# EAGLE design CR2032 Power Module (EAGLE 6.1)
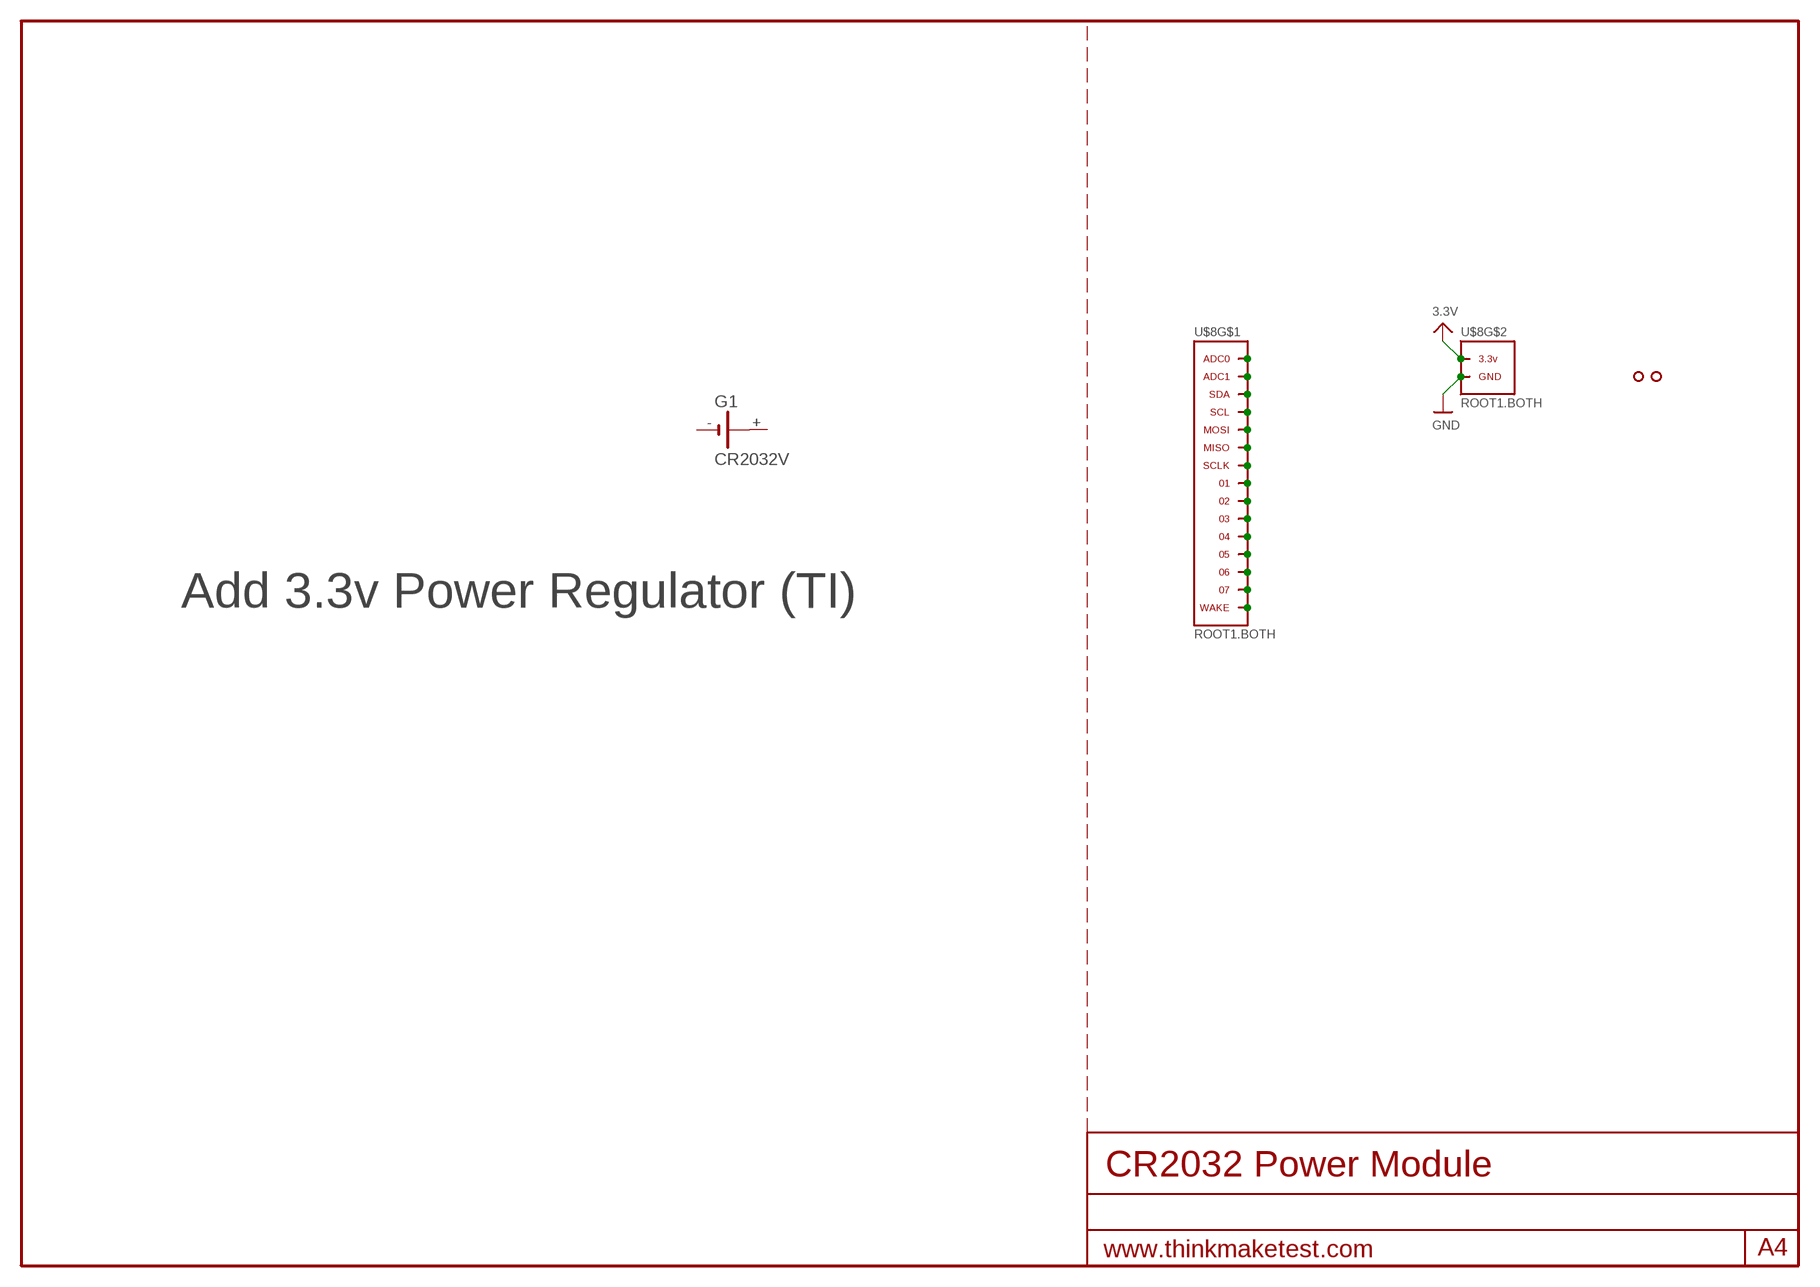
[diagram p0: schematic, sheet 1]

## Parts
G1  CR2032V  [CR2032V]
U$3  HOLE.2MM  [2MM]
U$4  HOLE.2MM  [2MM]
U$8  ROOT1.BOTH  [ROOT1.BOTH]

## Nets
3.3V: U$8.3.3V@1(3.3V) U$8.3.3V@2(3.3V) U$8.3.3V@3(3.3V) U$8.3.3V@4(3.3V) U$8.3.3V@5(3.3V) U$8.3.3V@6(3.3V) U$8.3.3V@7(3.3V) U$8.3.3V@8(3.3V) U$8.3.3V@9(3.3V) U$8.3.3V@10(3.3V) U$8.3.3V@VIA(3.3V)
GND: U$8.GND@1(GND) U$8.GND@2(GND) U$8.GND@3(GND) U$8.GND@4(GND) U$8.GND@5(GND) U$8.GND@6(GND) U$8.GND@7(GND) U$8.GND@8(GND) U$8.GND@9(GND) U$8.GND@10(GND) U$8.GND@11(GND) U$8.GND@12(GND) U$8.GND@13(GND) U$8.GND@14(GND) U$8.GND@15(GND) U$8.GND@16(GND) U$8.GND@17(GND) U$8.GND@18(GND) U$8.GND@19(GND) U$8.GND@20(GND) U$8.GND@VIA(GND)
N$1: U$8.ADC0 U$8.ADC0@1(ADC0) U$8.ADC0@VIA(ADC0)
N$2: U$8.ADC1 U$8.ADC1@1(ADC1) U$8.ADC1@VIA(ADC1)
N$3: U$8.SDA U$8.SDA@1(SDA) U$8.SDA@VIA(SDA)
N$4: U$8.SCL U$8.SCL@1(SCL) U$8.SCL@VIA(SCL)
N$5: U$8.MOSI U$8.MOSI@1(MOSI) U$8.MOSI@VIA(MOSI)
N$6: U$8.MISO U$8.MISO@1(MISO) U$8.MISO@VIA(MISO)
N$7: U$8.SCLK U$8.SCLK@1(SCLK) U$8.SCLK@VIA(SCLK)
N$8: U$8.01 U$8.01@1 U$8.01@VIA
N$9: U$8.02 U$8.02@1 U$8.02@VIA
N$10: U$8.03 U$8.03@1 U$8.03@VIA
N$11: U$8.04 U$8.04@1 U$8.04@VIA
N$12: U$8.05 U$8.05@1 U$8.05@VIA
N$13: U$8.06 U$8.06@1 U$8.06@VIA
N$14: U$8.07 U$8.07@1 U$8.07@VIA
N$15: U$8.WAKE U$8.WAKE@1(WAKE) U$8.WAKE@VIA(WAKE)
Unconnected: G1.+ G1.+@1(+) G1.-

## Notes on the sheet
- Add 3.3v Power Regulator (TI)

## Library data of the parts
G1 = battery:CR2032V: LI BATTERY Varta
U$3 U$4 = .screw_holes:HOLE
U$8 = thinkmaketest:ROOT1

## Board
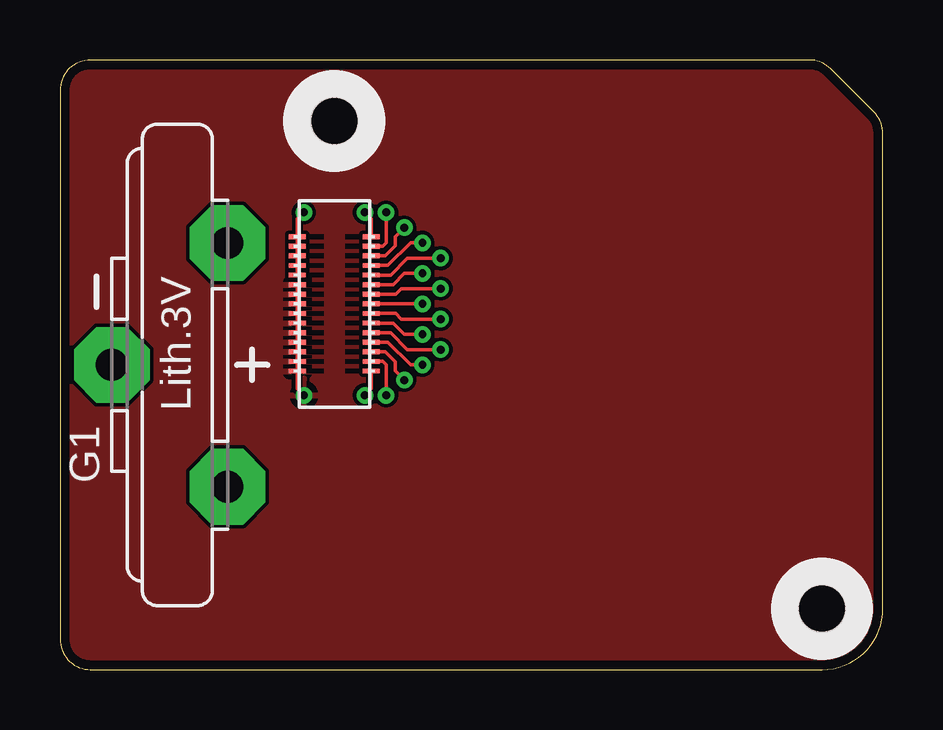
[diagram p1: board, top side]
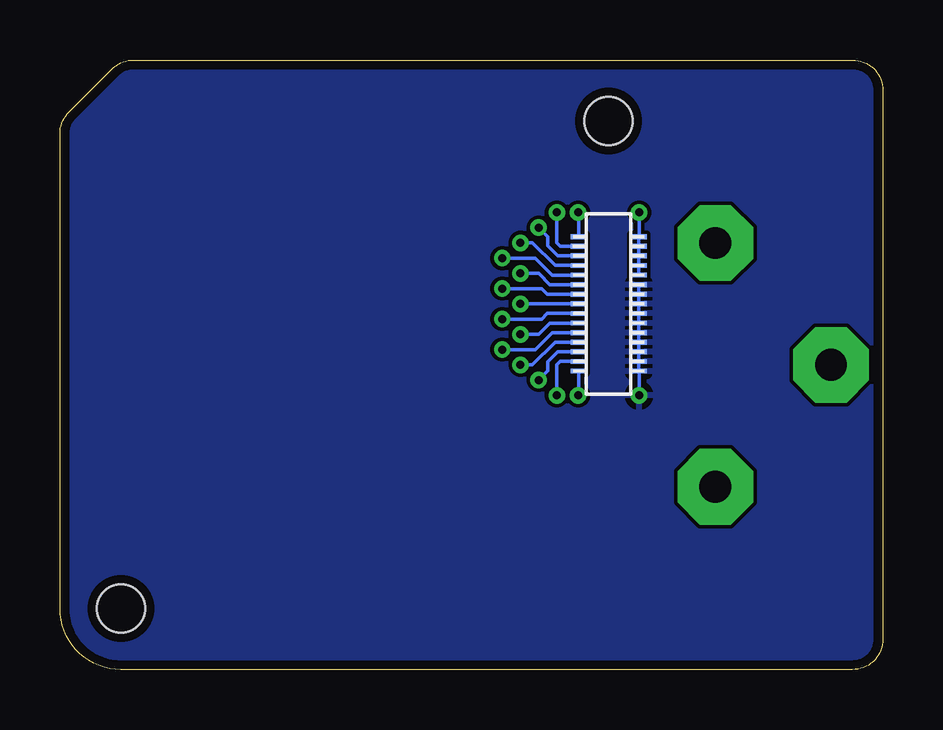
[diagram p2: board, bottom side, seen from below]

Size 34.29 x 25.4 mm. Coordinates in mm from the lower left corner, seen from the top.
Outline: 31.22,25.4 1.27,25.4 arc90 0,24.13 0,1.27 arc90 1.27,0 31.75,0 arc90 34.29,2.54 34.29,22.33 arc45 33.92,23.23 32.12,25.03 arc45 31.22,25.4
Copper layers (1*16): Top 0.0356mm / dielectric 1.5011mm / Bottom 0.0356mm
Design rules: minimum track width 6mil, minimum drill 13mil, track to track 6mil, track to pad 6mil, pad to pad 6mil, via to via 6mil, smd to smd 6mil, copper to edge 15mil, drill to drill 6mil, minimum pad ring 7mil, minimum via ring 7mil, stop-mask expansion 4mil, vias tented up to drill 16mil, thermal gap 10mil

### Footprints (pad centres in the part's own frame; a part is rotated, then mirrored left to right if it is on the bottom)
CR2032V = drill 1.321 pad 3.15 octagon: + -2.54,-5.08; +@1 -2.54,5.08; - 2.286,0
2MM = hole 2: 0,0
ROOT1.BOTH = smd 0.7 x 0.2: 01 4.08,15.24; 02 4.08,14.84; 03 4.08,14.44; 3.3V@1 1,18.04; 3.3V@2 1,17.64; 3.3V@3 1,17.24; 3.3V@4 1,16.84; 3.3V@5 1,16.44; 04 4.08,14.04; 05 4.08,13.64; 06 4.08,13.24; 07 4.08,12.84; ADC0 4.08,18.04; ADC1 4.08,17.64; GND@1 1,16.04; GND@2 1,15.64; GND@3 1,15.24; GND@4 1,14.84; GND@5 1,14.44; GND@6 1,14.04; GND@7 1,13.64; GND@8 1,13.24; GND@9 1,12.84; GND@10 1,12.44; MISO 4.08,16.04; MOSI 4.08,16.44; SCL 4.08,16.84; SCLK 4.08,15.64; SDA 4.08,17.24; WAKE 4.08,12.44 | smd 0.66 x 0.2 bottom: 01@1 3.795,15.24; 02@1 3.795,14.84; 3.3V@6 1.285,16.44; 3.3V@7 1.285,16.84; 3.3V@8 1.285,17.24; 3.3V@9 1.285,17.64; 3.3V@10 1.285,18.04; 03@1 3.795,14.44; 04@1 3.795,14.04; 05@1 3.795,13.64; 06@1 3.795,13.24; 07@1 3.795,12.84; ADC0@1 3.795,18.04; ADC1@1 3.795,17.64; GND@11 1.285,12.44; GND@12 1.285,12.84; GND@13 1.285,13.24; GND@14 1.285,13.64; GND@15 1.285,14.04; GND@16 1.285,14.44; GND@17 1.285,14.84; GND@18 1.285,15.24; GND@19 1.285,15.64; GND@20 1.285,16.04; MISO@1 3.795,16.04; MOSI@1 3.795,16.44; SCL@1 3.795,16.84; SCLK@1 3.795,15.64; SDA@1 3.795,17.24; WAKE@1 3.795,12.44 | drill 0.33 pad 0.686: 01@VIA 6.215,15.24; 02@VIA 6.973,14.605; 3.3V@VIA 1.27,19.05; 03@VIA 6.215,13.97; 04@VIA 6.973,13.335; 05@VIA 6.215,12.7; 06@VIA 5.457,12.065; 07@VIA 4.699,11.43; ADC0@VIA 3.81,19.05; ADC1@VIA 4.699,19.05; GND@VIA 1.27,11.43; MISO@VIA 6.215,16.51; MOSI@VIA 6.973,17.145; SCL@VIA 6.215,17.78; SCLK@VIA 6.973,15.875; SDA@VIA 5.457,18.415; WAKE@VIA 3.81,11.43

### Placement (x,y rotation side)
G1  4.45,12.7 180 top
U$3  31.75,2.54 90 top
U$4  11.43,22.86 90 top
U$8  8.89,0 0 top

### Tracks (layer width: path | path; a pad name or v marks a point on that pad's centre or on a via)
GND
  pour Bottom: 0,0 34.29,0 34.29,25.4 0,25.4
  pour Top: 0,0 34.29,0 34.29,25.4 0,25.4